# EAGLE design ASD2811 (EAGLE 6.3)
DATABASE: ./../../../../../Components/TinyCircuits_Part_Database.txt
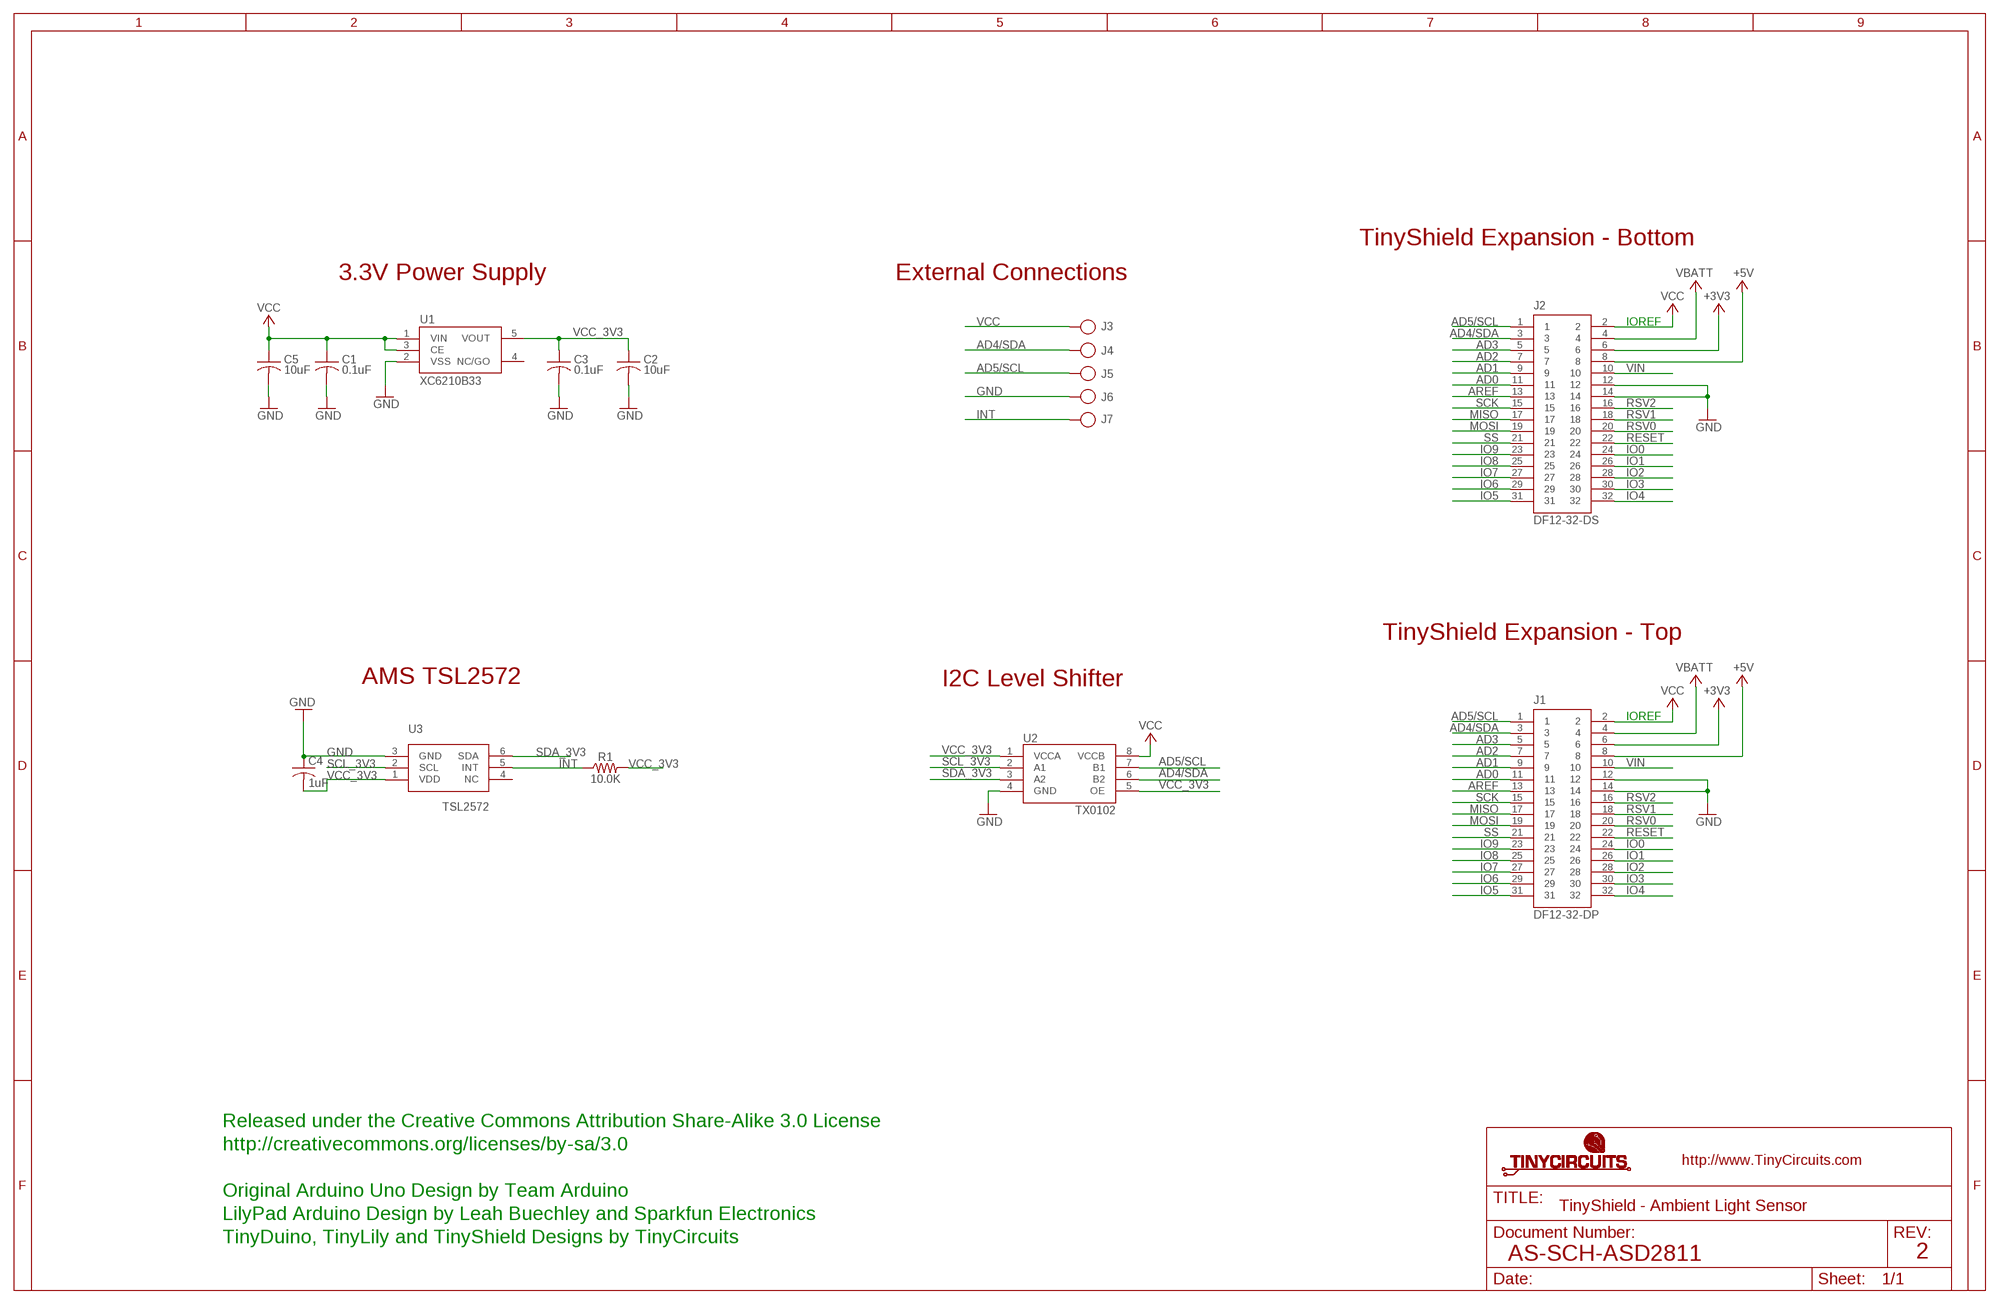
[diagram p0: schematic, sheet 1]

## Parts
C1  0.1uF  AS-ITM-00008  [C0402]
C2  10uF  AS-ITM-00045  [C0805]
C3  0.1uF  AS-ITM-00008  [C0402]
C4  1uF  AS-ITM-00105  [C0402]
C5  10uF  AS-ITM-00045  [C0805]
J1  DF12-32-DP  AS-ITM-00015  [DF12-32-DP]
J2  DF12-32-DS  AS-ITM-00012  [DF12-32-DS]
J3  PIN_1X.1"  [1X.1"]
J4  PIN_1X.1"  [1X.1"]
J5  PIN_1X.1"  [1X.1"]
J6  PIN_1X.1"  [1X.1"]
J7  PIN_1X.1"  [1X.1"]
R1  10.0K  AS-ITM-00032  [0402]
U1  XC6210B33  AS-ITM-00046  [SOT-25]
U2  TX0102  AS-ITM-00073  [DQE(R-PX2SON-N8)]
U3  TSL2572  AS-ITM-00116  [TSL2572]

## Nets
+3V3: J1.6 J2.6
+5V: J1.8 J2.8
AD0: J1.11 J2.11
AD1: J1.9 J2.9
AD2: J1.7 J2.7
AD3: J1.5 J2.5
AD4/SDA: J1.3 J2.3 J4.1 U2.6(B2)
AD5/SCL: J1.1 J2.1 J5.1 U2.7(B1)
AREF: J1.13 J2.13
GND: C1.2 C2.2 C3.2 C4.1 C5.2 J1.12 J1.14 J2.12 J2.14 J6.1 U1.2(VSS) U2.4(GND) U3.3(GND)
INT: J7.1 R1.1 U3.5(INT)
IO0: J1.24 J2.24
IO1: J1.26 J2.26
IO2: J1.28 J2.28
IO3: J1.30 J2.30
IO4: J1.32 J2.32
IO5: J1.31 J2.31
IO6: J1.29 J2.29
IO7: J1.27 J2.27
IO8: J1.25 J2.25
IO9: J1.23 J2.23
MISO: J1.17 J2.17
MOSI: J1.19 J2.19
RESET: J1.22 J2.22
RSV0: J1.20 J2.20
RSV1: J1.18 J2.18
RSV2: J1.16 J2.16
SCK: J1.15 J2.15
SCL_3V3: U2.2(A1) U3.2(SCL)
SDA_3V3: U2.3(A2) U3.6(SDA)
SS: J1.21 J2.21
VBATT: J1.4 J2.4
VCC: C1.1 C5.1 J1.2 J2.2 J3.1 U1.1(VIN) U1.3(CE) U2.8(VCCB)
VCC_3V3: C2.1 C3.1 C4.2 R1.2 U1.5(VOUT) U2.1(VCCA) U2.5(OE) U3.1(VDD)
VIN: J1.10 J2.10
Unconnected: U1.4(NC/GO) U3.4(NC)

## Notes on the sheet
- TinyShield Expansion - Bottom
- 3.3V Power Supply | External Connections
- IOREF
- TinyShield Expansion - Top
- AMS TSL2572 | I2C Level Shifter
- IOREF
- Released under the Creative Commons Attribution Share-Alike 3.0 License
- http://creativecommons.org/licenses/by-sa/3.0
- Original Arduino Uno Design by Team Arduino
- TinyShield - Ambient Light Sensor
- LilyPad Arduino Design by Leah Buechley and Sparkfun Electronics
- TinyDuino, TinyLily and TinyShield Designs by TinyCircuits
- AS-SCH-ASD2811 | 2

## Library data of the parts
C1 C3 = tinycircuits:AS-ITM-00008: CAP CER 0.1UF 16V 10% X5R 0402; PARTNO: AS-ITM-00008
C2 C5 = tinycircuits:AS-ITM-00045: CAP CER 16UF 16V 20% X5R 0805; PARTNO: AS-ITM-00045
C4 = tinycircuits:AS-ITM-00105: CAP CER 1UF 6.3V 10% X5R 0402; PARTNO: AS-ITM-00105
J1 = tinycircuits:AS-ITM-00015: CONN HEADER 32POS 3MM SMD 0.5MM; PARTNO: AS-ITM-00015
J2 = tinycircuits:AS-ITM-00012: CONN RECEPT 32POS 3MM SMD 0.5MM; PARTNO: AS-ITM-00012
J3-J7 = tinycircuits:PIN_1X.1": 1 Pin 0.100" Header
R1 = tinycircuits:AS-ITM-00032: RES 10.0K OHM 1/16W 1% 0402 SMD; PARTNO: AS-ITM-00032
U1 = tinycircuits:AS-ITM-00046: IC REG LDO 3.3V .7A SOT-25; PARTNO: AS-ITM-00046
U2 = tinycircuits:AS-ITM-00073: TI 2-Bit Bidirectional Voltage-Level Translator; PARTNO: AS-ITM-00073; VALUE: TXS0102
U3 = tinycircuits:AS-ITM-00116: Light-To-Digital Converter, TSL2572; PARTNO: AS-ITM-00116

## Board
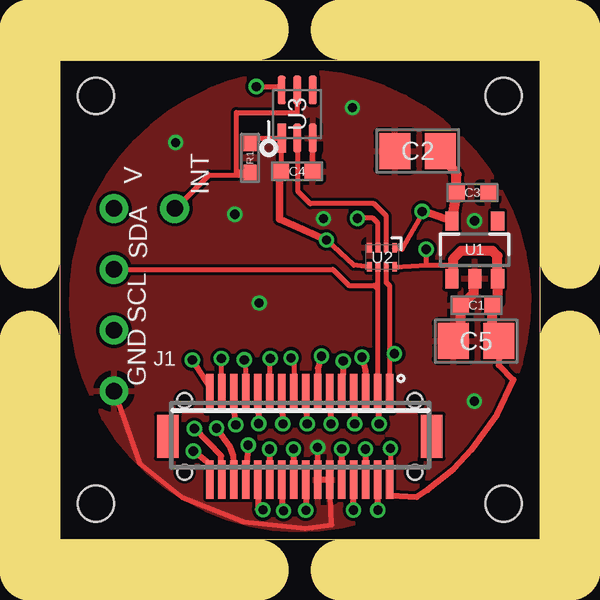
[diagram p1: board, top side]
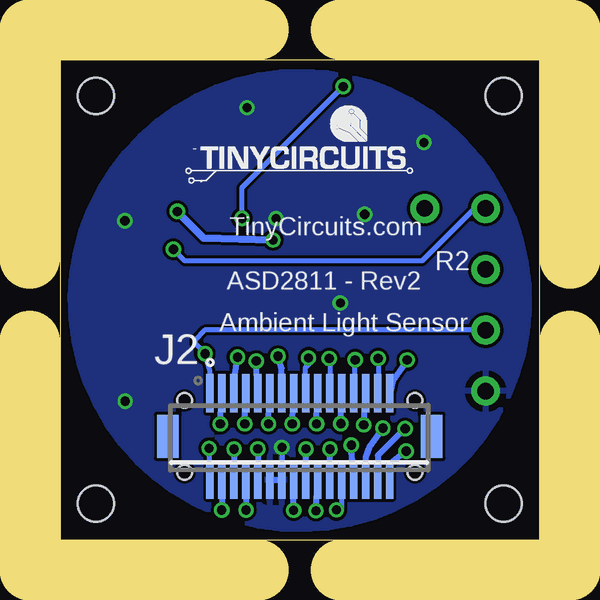
[diagram p2: board, bottom side, seen from below]

Size 20 x 20 mm. Coordinates in mm from the lower left corner, seen from the top.
Outline: 0,20 20,20 20,0 0,0 0,20
Copper layers (1*16): Top 0.035mm / dielectric 1.5mm / Bottom 0.035mm
Design rules "default *": minimum track width 5mil, minimum drill 15mil, track to track 5mil, track to pad 5mil, pad to pad 5mil, via to via 6mil, smd to smd 5mil, copper to edge 6mil, drill to drill 8mil, minimum pad ring 10mil, minimum via ring 5mil, stop-mask expansion 4mil, vias tented up to drill 25mil, thermal gap 10mil
Holes 1.5 mm at 1.5,18.5 18.5,18.5 18.5,1.5 1.5,1.5
Milling: 8 lines

### Footprints (pad centres in the part's own frame; a part is rotated, then mirrored left to right if it is on the bottom)
C0402 = smd 0.65 x 0.6: 1 -0.65,0; 2 0.65,0
C0805 = smd 1.3 x 1.5: 1 -0.95,0; 2 0.95,0
DF12-32-DP = smd 0.3 x 1.6: 1 -3.75,-1.8; 2 -3.75,1.8; 3 -3.25,-1.8; 4 -3.25,1.8; 5 -2.75,-1.8; 6 -2.75,1.8; 7 -2.25,-1.8; 8 -2.25,1.8; 9 -1.75,-1.8; 10 -1.75,1.8; 11 -1.25,-1.8; 12 -1.25,1.8; 13 -0.75,-1.8; 14 -0.75,1.8; 15 -0.25,-1.8; 16 -0.25,1.8; 17 0.25,-1.8; 18 0.25,1.8; 19 0.75,-1.8; 20 0.75,1.8; 21 1.25,-1.8; 22 1.25,1.8; 23 1.75,-1.8; 24 1.75,1.8; 25 2.25,-1.8; 26 2.25,1.8; 27 2.75,-1.8; 28 2.75,1.8; 29 3.25,-1.8; 30 3.25,1.8; 31 3.75,-1.8; 32 3.75,1.8 | smd 0.9 x 1.8: F1 -5.5,0; F2 5.5,0 | hole 0.6: -4.8,1.5; 4.8,1.5
DF12-32-DS = smd 0.3 x 1.6: 1 -3.75,1.8; 2 -3.75,-1.8; 3 -3.25,1.8; 4 -3.25,-1.8; 5 -2.75,1.8; 6 -2.75,-1.8; 7 -2.25,1.8; 8 -2.25,-1.8; 9 -1.75,1.8; 10 -1.75,-1.8; 11 -1.25,1.8; 12 -1.25,-1.8; 13 -0.75,1.8; 14 -0.75,-1.8; 15 -0.25,1.8; 16 -0.25,-1.8; 17 0.25,1.8; 18 0.25,-1.8; 19 0.75,1.8; 20 0.75,-1.8; 21 1.25,1.8; 22 1.25,-1.8; 23 1.75,1.8; 24 1.75,-1.8; 25 2.25,1.8; 26 2.25,-1.8; 27 2.75,1.8; 28 2.75,-1.8; 29 3.25,1.8; 30 3.25,-1.8; 31 3.75,1.8; 32 3.75,-1.8 | smd 0.9 x 1.8: F1 -5.5,0; F2 5.5,0 | hole 0.6: -4.8,1.5; 4.8,1.5
1X.1" = drill 0.7 pad 1.016: 1 0,0
0402 = smd 0.65 x 0.55: 1 -0.6,0; 2 0.6,0
SOT-25 = smd 0.55 x 0.8: 1 -0.95,-1.2; 2 0,-1.2; 3 0.95,-1.2; 4 0.95,1.2; 5 -0.95,1.2
DQE(R-PX2SON-N8) = smd 0.2 x 0.4: 1 -0.525,-0.4; 2 -0.175,-0.4; 3 0.175,-0.4; 4 0.525,-0.4; 5 0.525,0.4; 6 0.175,0.4; 7 -0.175,0.4; 8 -0.525,0.4
TSL2572 = smd 1.2 x 0.35: 1 -1,0.65; 2 -1,0; 3 -1,-0.65; 4 1,-0.65; 5 1,0; 6 1,0.65

### Placement (x,y rotation side)
C1  17.37,9.77 180 top
C2  14.92,16.2 180 top
C3  17.2,14.47 0 top
C4  9.88,15.35 180 top
C5  17.35,8.28 180 top
J1  10,4.3 180 top
J2  10,4.3 0 bottom
J3  2.25,13.81 0 top
J4  2.25,11.27 0 top
J5  2.25,8.73 0 top
J6  2.25,6.19 0 top
J7  4.79,13.81 0 top
R1  7.93,15.92 90 top
U1  17.3,12.08 0 top
U2  13.43,11.77 180 top
U3  9.89,17.74 90 top
U$1  [DOCFIELD-TINYCIRCUITS-PCB]  33.91,-10 0 top  (outside the outline)

### Tracks (layer width: path | path; a pad name or v marks a point on that pad's centre or on a via)
+3V3  (via drill 0.38)
  Top 0.254: J2.6 v12.75,3.77 v12.74,3.77
  Bottom 0.254: v12.74,3.77 12.74,2.51 J2.6
+5V  (via drill 0.38)
  Top 0.254: v12.24,1.23 J2.8
  Bottom 0.254: J2.8 12.25,1.21 v12.24,1.23
AD0  (via drill 0.38)
  Top 0.254: v11.3,4.83 11.31,5.05 J2.11
  Bottom 0.254: J2.11 11.28,5.79 v11.3,4.83
AD1  (via drill 0.38)
  Top 0.254: J2.9 11.79,6.27 v11.81,7.44
  Bottom 0.254: v11.81,7.44 11.78,6.22 J2.9
AD2  (via drill 0.38)
  Top 0.254: v12.29,4.83 12.31,5.05 J2.7
  Bottom 0.254: J2.7 12.27,5.86 v12.29,4.83
AD3  (via drill 0.38)
  Top 0.254: J2.5 12.73,7.04 v12.6,7.61
  Bottom 0.254: v12.6,7.61 12.78,6.3 J2.5
AD4/SDA  (via drill 0.38)
  Top 0.203: J2.3 13.25,10.45 | 13.25,10.45 13.25,10.82 13.25,10.91 13.26,11.45 U2.6 | J4.1 11.38,11.27 12.05,10.6 13.11,10.6 13.25,10.45
  Top 0.254: v13.31,4.83 13.31,5 J2.3
  Bottom 0.254: J2.3 13.28,5.86 v13.31,4.83
AD5/SCL  (via drill 0.38)
  Top 0.203: J2.1 13.75,7.73 | 13.75,7.73 13.75,10.58 13.61,10.72 13.61,11.44 U2.7 | v13.95,7.75 13.77,7.75 13.75,7.73
  Bottom 0.203: J2.1 13.75,7.02 v13.95,7.75 14.37,8.17 14.37,8.32 13.97,8.73 J5.1
AREF  (via drill 0.38)
  Top 0.254: J2.13 10.75,7.15 v10.91,7.64
  Bottom 0.254: v10.91,7.64 10.76,7.14 J2.13
GND  (via drill 0.38)
  Top 0.203: J6.1 3.32,3.19 5.09,1.77 7.68,0.73 10.23,0.46 11.32,0.61 J2.12 | U3.3 C4.1 | J2.14 v10.75,3.85
  Top 0.254: J2.12 J2.14
  Top 0.406: C5.2 16.72,8.05 C1.2 16.72,9.74 17.26,10.28 17.26,10.84 U1.2
  Bottom 0.203: v10.75,3.85 J2.14
  Bottom 0.254: J2.12 J2.14
  other vias: 17.28,5.77 4.83,16.56 7.29,13.56 12.19,18.01 8.31,9.86 10.99,13.39 17.29,13.29
  pour Top: 18.49,5.61 arc180 1.54,14.32 arc180
  pour Bottom: 18.49,5.61 arc180 1.5,14.34 arc180
INT
  Top 0.203: J7.1 4.81,13.81 6.21,15.2 7.82,15.2 R1.1 7.36,15.32 7.36,17.81 9.9,17.81 U3.5
IO0  (via drill 0.38)
  Top 0.254: J2.24 8.25,1.26 v8.47,1.23
  Bottom 0.203: v8.47,1.23 8.43,1.28 8.25,1.27 J2.24
  Bottom 0.254: J2.24
IO1  (via drill 0.38)
  Top 0.254: v7.85,3.94 J2.26
  Bottom 0.254: 7.85,3.66 J2.26 v7.85,3.94
IO2  (via drill 0.38)
  Top 0.254: v6.53,4.64 7.07,3.89 7.22,3.49 7.29,2.61 7.26,2.51 J2.28
  Bottom 0.254: J2.28 7.24,3.43 7.07,3.88 v6.53,4.64
IO3  (via drill 0.38)
  Top 0.254: J2.30 6.73,3.49 v5.61,4.63
  Bottom 0.254: v5.61,4.63 6.75,3.51 6.77,2.53 J2.30
IO4  (via drill 0.38)
  Top 0.254: J2.32 6.25,3.14 v5.56,3.69
  Bottom 0.254: v5.56,3.69 5.61,3.65 6.21,3.18 6.21,3.14 6.26,3.1 J2.32
IO5  (via drill 0.38)
  Top 0.254: v5.52,7.49 6.23,6.38 J2.31
  Bottom 0.254: J2.31 6.11,6.64 v5.52,7.49
IO6  (via drill 0.38)
  Top 0.203: J2.29 6.74,7.5 6.74,7.76 v6.73,7.56 v6.73,7.55
  Top 0.254: J2.29
  Bottom 0.203: v6.73,7.55 6.74,6.11 J2.29
IO7  (via drill 0.38)
  Top 0.254: v7.33,4.78 7.31,4.9 J2.27
  Bottom 0.254: J2.27 7.29,5.76 v7.33,4.78
IO8  (via drill 0.38)
  Top 0.203: 7.76,6.11 J2.25 7.71,7.49 v7.69,7.5
  Bottom 0.203: J2.25 7.71,6.1 v7.69,7.5
IO9  (via drill 0.38)
  Top 0.254: v8.29,4.83 8.31,4.98 J2.23
  Bottom 0.254: J2.23 8.28,5.59 v8.29,4.83
MISO  (via drill 0.38)
  Top 0.203: v9.63,7.58 9.75,7.46 J2.17
  Bottom 0.203: J2.17 9.76,6.11 9.76,7.17 9.63,7.3 v9.63,7.58
MOSI  (via drill 0.38)
  Top 0.254: v9.3,4.83 9.31,4.95 J2.19
  Bottom 0.254: J2.19 9.27,5.76 v9.3,4.83
RESET  (via drill 0.38)
  Top 0.254: v8.74,3.77 J2.22
  Bottom 0.254: J2.22 8.75,3.69 v8.74,3.77
RSV0  (via drill 0.38)
  Top 0.254: J2.20 9.25,1.2 v9.32,1.2
  Bottom 0.254: v9.32,1.2 J2.20
RSV1  (via drill 0.38)
  Top 0.254: v9.74,3.77 9.74,2.51 J2.18
  Bottom 0.254: J2.18 9.75,3.72 v9.74,3.77
RSV2  (via drill 0.38)
  Top 0.254: J2.16 10.25,1.16 v10.25,1.22
  Bottom 0.254: v10.25,1.22 J2.16
SCK  (via drill 0.38)
  Top 0.254: v10.31,4.83 10.31,4.98 J2.15
  Bottom 0.254: J2.15 10.29,5.66 v10.31,4.83
SCL_3V3
  Top 0.203: U2.2 13.61,13.49 13.1,14 10.44,14 9.94,14.5 9.94,16.7 U3.2
SDA_3V3  (via drill 0.38)
  Top 0.203: U3.6 9.09,18.89 v8.19,18.89 | U2.3 13.26,13.2 13.06,13.4 12.42,13.4 v12.41,13.39
  Bottom 0.203: v12.41,13.39 12.41,14.67 v8.19,18.89
SS  (via drill 0.38)
  Top 0.203: J2.21 8.77,6.12 v8.77,7.55
  Bottom 0.203: v8.77,7.55 8.75,7.53 J2.21
VBATT  (via drill 0.38)
  Top 0.254: v13.25,1.23 J2.4
  Bottom 0.254: J2.4 13.25,1.24 v13.25,1.23
VCC  (via drill 0.38)
  Top 0.203: v13.78,3.81 J2.2 | U2.8 15.33,11.44 | 15.33,11.44 16.37,11.44 16.39,11.42 | v15.27,12.11 15.27,11.5 15.33,11.44
  Top 0.254: C5.1 18.3,7.28 18.92,6.66 18.23,5.2 17.15,3.74 16.4,2.93 15.33,2.07 14.87,1.77 13.8,1.83 J2.2
  Top 0.406: C5.1 18.02,8.33 C1.1 18.25,9.94 U1.3 18.25,11.82 18.04,12.03 16.73,12.03 16.39,11.69 16.39,11.42 16.39,10.92 U1.1
  Bottom 0.203: J2.2 v13.78,3.81 | J3.1 2.71,13.81 4.9,11.62 14.79,11.62 v15.27,12.11
VCC_3V3  (via drill 0.38)
  Top 0.203: R1.2 7.93,16.74 U3.1 C4.2 9.18,15.35 9.16,15.32 | 15.18,13.69 14.26,12.11 13.96,12.11 U2.1 | U2.5 12.25,11.44 v11.12,12.49
  Top 0.305: U1.5 15.18,13.69 15.25,13.68 v15.11,13.68 | 9.16,15.32 9.16,13.37 v11.12,12.49
  Top 0.406: U1.5 C3.1 16.54,15.24 C2.1
  Bottom 0.305: v11.12,12.49 14,12.58 v15.11,13.68
VIN  (via drill 0.38)
  Top 0.254: J2.10 v11.76,3.78 v11.75,3.78
  Bottom 0.254: v11.75,3.78 J2.10

### Text on the board
tPlace: V | INT | SDA | SCL | GND
bPlace: TinyCircuits.com | ASD2811 - Rev2 | Ambient Light Sensor
bNames: R2
Document: FABRICATION DRAWING | NOTES: | 1. PRINTED CIRCUIT BOARD MADE FROM NEMA GRADE FR-4 EPOXY LAMINATE | WITH 1 OUNCE COPPER PLATING AND .024 THICKNESS. | 2. ALL DIMENSIONS ARE GIVEN IN INCHES. | 3. CIRCUIT PATHS ARE FOR REFERENCE ONLY. | 4. HOLE SIZES SHOWN ARE FINISHED DIAMETERS AFTER PLATING. | 5. BOARD PLATED USING REFLOW OR SIMILAR METHOD. | 6. BOARD TO HAVE BLUE SOLDER MASK ON PLATED SURFACES USING WET FILM | 7. SILKSCREEN BOARD USING WHITE INK. | SR100 OR SR1010 EPOXY. EQUIVALENT WET OR DRY FILM MAY BE USED. | 8. THE FOLLOWING INFORMATION APPLIES TO THIS BOARD: | * 2 COPPER LAYERS | * .024 BOARD THICKNESS | * REQUIRES TOP SIDE SILKSCREEN | Released under the Creative Commons Attribution Share-Alike 3.0 License | http://creativecommons.org/licenses/by-sa/3.0 | Original Arduino Uno Design by Team Arduino | LilyPad Arduino Design by Leah Buechley and Sparkfun Electronics | TinyDuino, TinyLily and TinyShield Designs by TinyCircuits | TinyShield - Ambient Light Sensor | AS-PCB-ASD2811 | 2